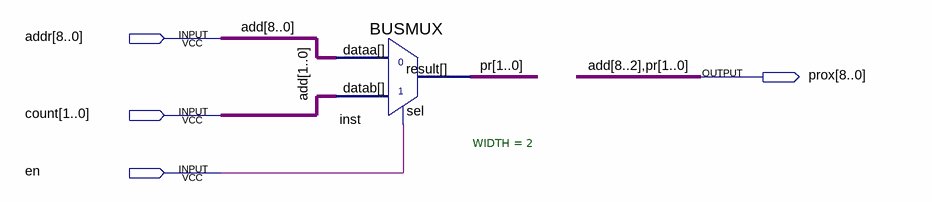
[diagram p0: schematic sheet]
// Quartus schematic Proxy.bdf as structural Verilog: 1 symbols, 4 pins
module Proxy (
  input  [8:0] addr,
  input  [1:0] count,
  input  en,
  output [8:0] prox
);

  BUSMUX #(.WIDTH(2)) inst (.datab(count), .sel(en), .dataa(addr[1:0]), .result(prox[1:0]));

  assign prox[8:2] = addr[8:2];

  // Other names for the same wires on the sheet: add[8:0] = addr; pr[1:0] = prox[1:0]
endmodule
